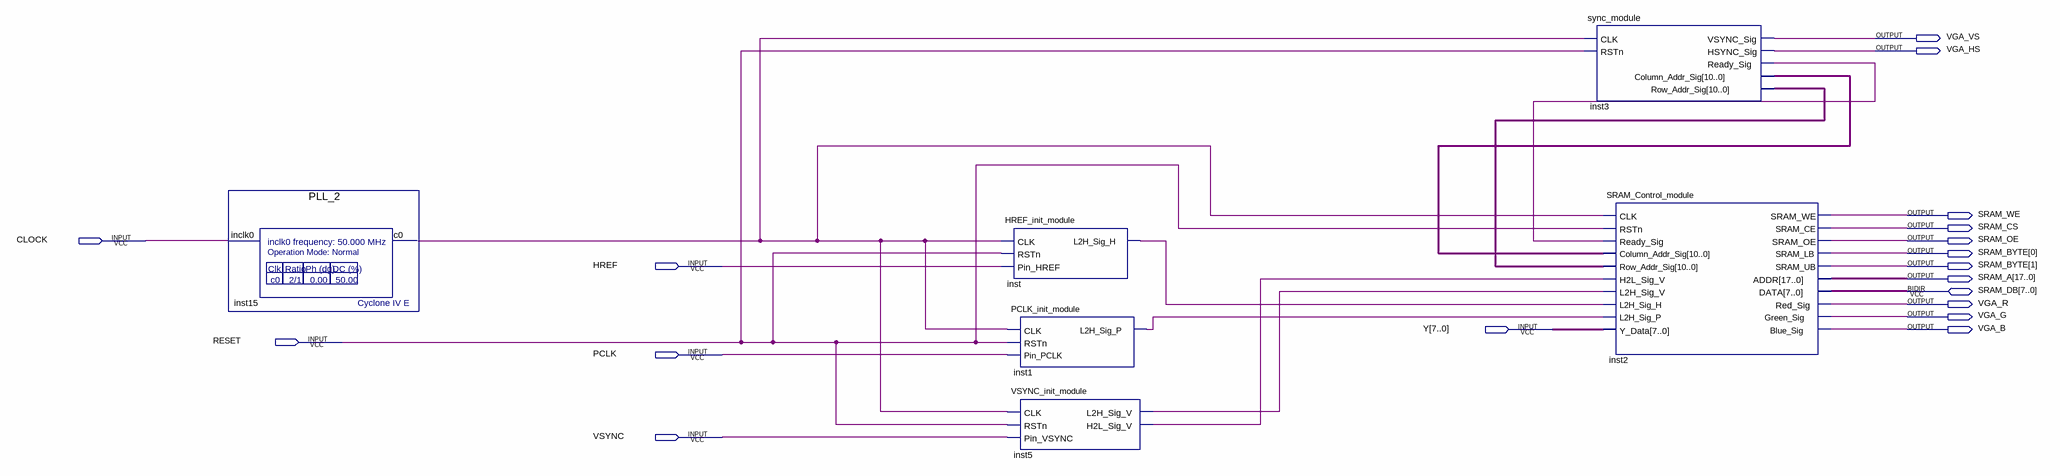
[diagram p0: schematic sheet]
// Quartus schematic OV_7620_BDF.bdf as structural Verilog: 6 symbols, 18 pins
module OV_7620_BDF (
  input  CLOCK,
  input  HREF,
  input  [7:0] Y,
  input  RESET,
  input  PCLK,
  input  VSYNC,
  inout  [7:0] SRAM_DB,
  output VGA_VS,
  output VGA_HS,
  output SRAM_WE,
  output SRAM_CS,
  output SRAM_OE,
  output [1:0] SRAM_BYTE,
  output [17:0] SRAM_A,
  output VGA_R,
  output VGA_G,
  output VGA_B
);

  wire inst1_l2h_sig_p, inst3_ready_sig, inst5_h2l_sig_v, inst5_l2h_sig_v, inst15_c0, inst_l2h_sig_h;
  wire [10:0] inst3_column_addr_sig, inst3_row_addr_sig;

  PLL_2 inst15 (.inclk0(CLOCK), .c0(inst15_c0));
  HREF_init_module inst (.CLK(inst15_c0), .RSTn(RESET), .Pin_HREF(HREF), .L2H_Sig_H(inst_l2h_sig_h));
  PCLK_init_module inst1 (.CLK(inst15_c0), .RSTn(RESET), .Pin_PCLK(PCLK), .L2H_Sig_P(inst1_l2h_sig_p));
  VSYNC_init_module inst5 (
    .CLK(inst15_c0), .RSTn(RESET), .Pin_VSYNC(VSYNC), .L2H_Sig_V(inst5_l2h_sig_v), .H2L_Sig_V(inst5_h2l_sig_v));
  sync_module inst3 (
    .CLK(inst15_c0), .RSTn(RESET), .VSYNC_Sig(VGA_VS), .HSYNC_Sig(VGA_HS), .Ready_Sig(inst3_ready_sig),
    .Column_Addr_Sig(inst3_column_addr_sig), .Row_Addr_Sig(inst3_row_addr_sig));
  SRAM_Control_module inst2 (
    .CLK(inst15_c0), .RSTn(RESET), .Ready_Sig(inst3_ready_sig), .Column_Addr_Sig(inst3_column_addr_sig),
    .Row_Addr_Sig(inst3_row_addr_sig), .H2L_Sig_V(inst5_h2l_sig_v), .L2H_Sig_V(inst5_l2h_sig_v),
    .L2H_Sig_H(inst_l2h_sig_h), .L2H_Sig_P(inst1_l2h_sig_p), .Y_Data(Y), .SRAM_WE(SRAM_WE),
    .SRAM_CE(SRAM_CS), .SRAM_OE(SRAM_OE), .SRAM_LB(SRAM_BYTE[0]), .SRAM_UB(SRAM_BYTE[1]), .ADDR(SRAM_A),
    .Red_Sig(VGA_R), .Green_Sig(VGA_G), .Blue_Sig(VGA_B), .DATA(SRAM_DB));
endmodule
